# Altium schematic sheet ArtixTranscievers.SchDoc
size A
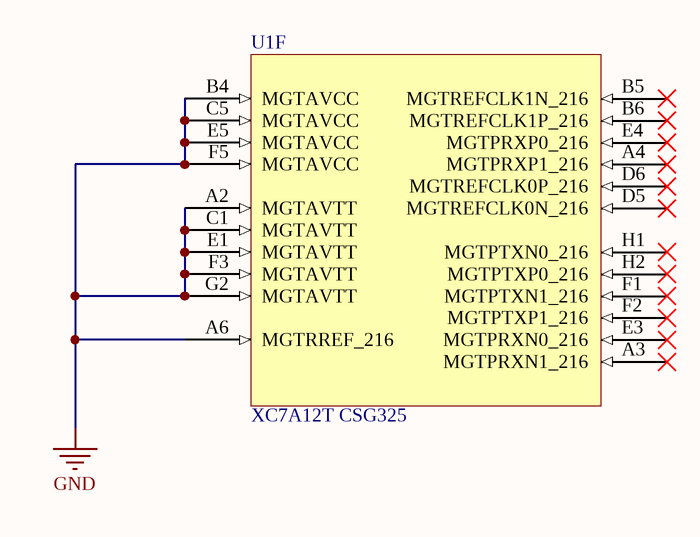
[diagram p0: ArtixTranscievers.SchDoc]

## Parts
U1  XC7A12T CSG325  [BGA324C80P18X18_1500X1500X150]  (part F of 7)

## Nets
GND: U1.A2(MGTAVTT) U1.A6(MGTRREF_216) U1.B4(MGTAVCC) U1.C1(MGTAVTT) U1.C5(MGTAVCC) U1.E1(MGTAVTT) U1.E5(MGTAVCC) U1.F3(MGTAVTT) U1.F5(MGTAVCC) U1.G2(MGTAVTT)

Not connected (* = marked no-connect by the designer): U1 A3(MGTPRXN1_216)* A4(MGTPRXP1_216)* B5(MGTREFCLK1N_216)* B6(MGTREFCLK1P_216)* D5(MGTREFCLK0N_216)* D6(MGTREFCLK0P_216)* E3(MGTPRXN0_216)* E4(MGTPRXP0_216)* F1(MGTPTXN1_216)* F2(MGTPTXP1_216)* H1(MGTPTXN0_216)* H2(MGTPTXP0_216)*

## Library data of the parts
U1 = XC7A12T_1CSG325I